# Altium schematic sheet pca10056_sheet3_pin_map.SchDoc: PCA10056 - Pin Map
size A3; Organization: Nordic Semiconductor; DocumentNumber: 3; SheetNumber: 3; SheetTotal: 7; CompanyName: Nordic Semiconductor
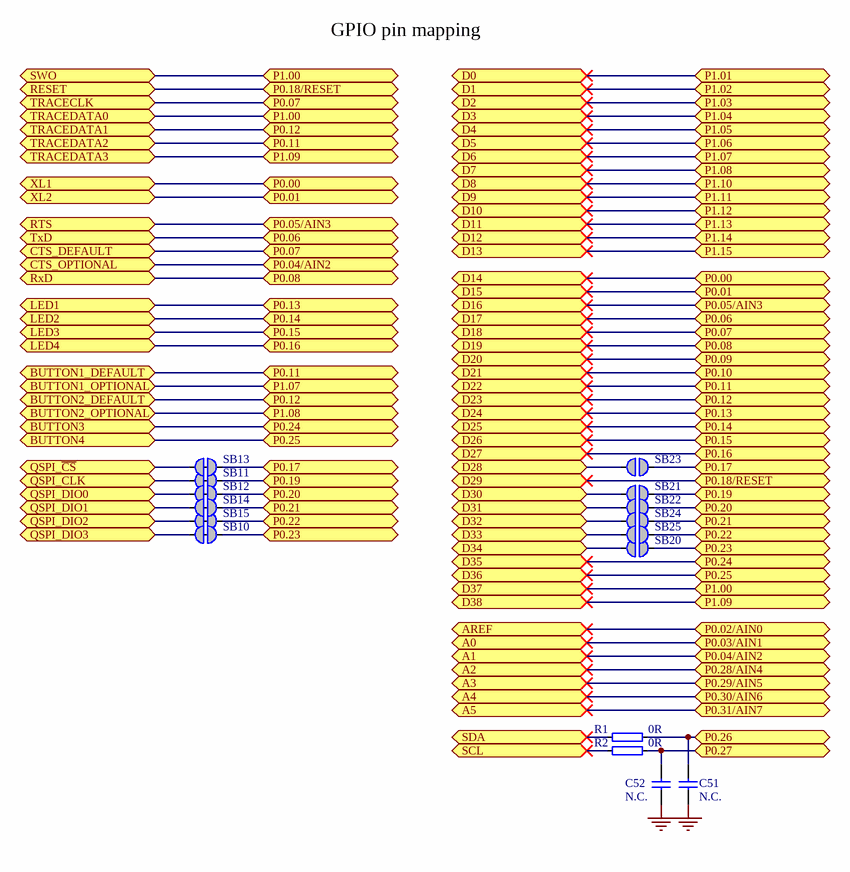
[diagram p0: pca10056_sheet3_pin_map.SchDoc]

## Parts
C51  N.C.  [CAPC1005X04L]
C52  N.C.  [CAPC1005X04L]
R1  0R  [RESC1005X04L]
R2  0R  [RESC1005X04L]
SB10  Solderbridge  [Solderbridge_Shorted]  (value not drawn)  (net tie, no BOM)
SB11  Solderbridge  [Solderbridge_Shorted]  (value not drawn)  (net tie, no BOM)
SB12  Solderbridge  [Solderbridge_Shorted]  (value not drawn)  (net tie, no BOM)
SB13  Solderbridge  [Solderbridge_Shorted]  (value not drawn)  (net tie, no BOM)
SB14  Solderbridge  [Solderbridge_Shorted]  (value not drawn)  (net tie, no BOM)
SB15  Solderbridge  [Solderbridge_Shorted]  (value not drawn)  (net tie, no BOM)
SB20  Solderbridge  [Solderbridge]  (value not drawn)  (no BOM)
SB21  Solderbridge  [Solderbridge]  (value not drawn)  (no BOM)
SB22  Solderbridge  [Solderbridge]  (value not drawn)  (no BOM)
SB23  Solderbridge  [Solderbridge]  (value not drawn)  (no BOM)
SB24  Solderbridge  [Solderbridge]  (value not drawn)  (no BOM)
SB25  Solderbridge  [Solderbridge]  (value not drawn)  (no BOM)

## Ports
A0 (bidir), A1 (bidir), A2 (bidir), A3 (bidir), A4 (bidir), A5 (bidir), AREF (bidir), BUTTON1_DEFAULT (bidir), BUTTON1_OPTIONAL (bidir), BUTTON2_DEFAULT (bidir), BUTTON2_OPTIONAL (bidir), BUTTON3 (bidir), BUTTON4 (bidir), CTS_DEFAULT (bidir), CTS_OPTIONAL (bidir), D0 (bidir), D1 (bidir), D2 (bidir), D3 (bidir), D4 (bidir), D5 (bidir), D6 (bidir), D7 (bidir), D8 (bidir), D9 (bidir), D10 (bidir), D11 (bidir), D12 (bidir), D13 (bidir), D14 (bidir), D15 (bidir), D16 (bidir), D17 (bidir), D18 (bidir), D19 (bidir), D20 (bidir), D21 (bidir), D22 (bidir), D23 (bidir), D24 (bidir), D25 (bidir), D26 (bidir), D27 (bidir), D28 (bidir), D29 (bidir), D30 (bidir), D31 (bidir), D32 (bidir), D33 (bidir), D34 (bidir), D35 (bidir), D36 (bidir), D37 (bidir), D38 (bidir), LED1 (bidir), LED2 (bidir), LED3 (bidir), LED4 (bidir), P0.00 (bidir), P0.01 (bidir), P0.02/AIN0 (bidir), P0.03/AIN1 (bidir), P0.04/AIN2 (bidir), P0.05/AIN3 (bidir), P0.06 (bidir), P0.07 (bidir), P0.08 (bidir), P0.09 (bidir), P0.10 (bidir), P0.11 (bidir), P0.12 (bidir), P0.13 (bidir), P0.14 (bidir), P0.15 (bidir), P0.16 (bidir), P0.17 (bidir), P0.18/RESET (bidir), P0.19 (bidir), P0.20 (bidir), P0.21 (bidir), P0.22 (bidir), P0.23 (bidir), P0.24 (bidir), P0.25 (bidir), P0.26 (bidir), P0.27 (bidir), P0.28/AIN4 (bidir), P0.29/AIN5 (bidir), P0.30/AIN6 (bidir), P0.31/AIN7 (bidir), P1.00 (bidir), P1.01 (bidir), P1.02 (bidir), P1.03 (bidir), P1.04 (bidir), P1.05 (bidir), P1.06 (bidir), P1.07 (bidir), P1.08 (bidir), P1.09 (bidir), P1.10 (bidir), P1.11 (bidir), P1.12 (bidir), P1.13 (bidir), P1.14 (bidir), P1.15 (bidir), QSPI_CLK (bidir), QSPI_DIO0 (bidir), QSPI_DIO1 (bidir), QSPI_DIO2 (bidir), QSPI_DIO3 (bidir), QSPI_~{CS} (bidir), RESET (bidir), RTS (bidir), RxD (bidir), SCL (bidir), SDA (bidir), SWO (bidir), TRACECLK (bidir), TRACEDATA0 (bidir), TRACEDATA1 (bidir), TRACEDATA2 (bidir), TRACEDATA3 (bidir), TxD (bidir), XL1 (bidir), XL2 (bidir)

## Nets
GND: C51.1 C52.2
A0: port A0, port P0.03/AIN1
A1: port P0.04/AIN2, port CTS_OPTIONAL, port A1
A2: port A2, port P0.28/AIN4
A3: port A3, port P0.29/AIN5
A4: port A4, port P0.30/AIN6
A5: port A5, port P0.31/AIN7
AREF: port AREF, port P0.02/AIN0
BUTTON1_DEFAULT: port TRACEDATA2, port P0.11, port BUTTON1_DEFAULT, port D22
BUTTON1_OPTIONAL: port P1.07, port BUTTON1_OPTIONAL, port D6
BUTTON2_DEFAULT: port TRACEDATA1, port P0.12, port BUTTON2_DEFAULT, port D23
BUTTON2_OPTIONAL: port P1.08, port BUTTON2_OPTIONAL, port D7
BUTTON3: port P0.24, port BUTTON3, port D35
BUTTON4: port P0.25, port BUTTON4, port D36
CTS_DEFAULT: port P0.07, port TRACECLK, port CTS_DEFAULT, port D18
D0: port P1.01, port D0
D1: port P1.02, port D1
D2: port P1.03, port D2
D3: port P1.04, port D3
D4: port P1.05, port D4
D5: port P1.06, port D5
D8: port P1.10, port D8
D9: port P1.11, port D9
D10: port P1.12, port D10
D11: port P1.13, port D11
D12: port P1.14, port D12
D13: port P1.15, port D13
D14: port P0.00, port XL1, port D14
D15: port P0.01, port XL2, port D15
D16: port RTS, port D16, port P0.05/AIN3
D17: port TxD, port P0.06, port D17
D19: port RxD, port P0.08, port D19
D20: port D20, port P0.09
D21: port D21, port P0.10
D24: port P0.13, port LED1, port D24
D25: port P0.14, port LED2, port D25
D26: port P0.15, port LED3, port D26
D27: port P0.16, port LED4, port D27
D28: SB23.2 ; port D28
D29: port RESET, port P0.18/RESET, port D29
D30: SB21.2 ; port D30
D31: SB22.2 ; port D31
D32: SB24.2 ; port D32
D33: SB25.2 ; port D33
D34: SB20.2 ; port D34
D37: port TRACEDATA0, port SWO, port P1.00, port D37
D38: port TRACEDATA3, port P1.09, port D38
P0.17: SB13.1 SB23.1 ; port P0.17
P0.19: SB11.1 SB21.1 ; port P0.19
P0.20: SB12.1 SB22.1 ; port P0.20
P0.21: SB14.1 SB24.1 ; port P0.21
P0.22: SB15.1 SB25.1 ; port P0.22
P0.23: SB10.1 SB20.1 ; port P0.23
P0.26: C51.2 R1.2 ; port P0.26
P0.27: C52.1 R2.2 ; port P0.27
QSPI_~{CS}: SB13.2 ; port QSPI_~{CS}
QSPI_CLK: SB11.2 ; port QSPI_CLK
QSPI_DIO0: SB12.2 ; port QSPI_DIO0
QSPI_DIO1: SB14.2 ; port QSPI_DIO1
QSPI_DIO2: SB15.2 ; port QSPI_DIO2
QSPI_DIO3: SB10.2 ; port QSPI_DIO3
SCL: R2.1 ; port SCL
SDA: R1.1 ; port SDA

## Notes on the sheet
- GPIO pin mapping
- Size
- Date:
- A3
- Project Number
- Sheet         of
- Revision
- File:
- Drawn By:

## Library data of the parts
C51 C52 = C0402-N.C.: Not mounted; Assembly: Not mounted; Note: Chip Cap; Artikkelnr Noca: N.A.; Part Number: C0402-N.C.; Manufacturer: *; Manufacturer Part Number: *; Datasheet: *; Footprint Doc: 0402; LatestRevisionDate: 2009-05-08; Pin Count: 2; Publisher: Nordic Semiconductor; Published: 2009-05-08; Value: N.C.; Supplier: *; Supplier part number: *; 2nd source Supplier: *; 2nd source part number: *; Artikkelnr Simpro: N.A.
R1 R2 = R0402-0R: Resistor, ±5%, 0.063W; Note: Chip Res 5%; Artikkelnr Noca: 27049000; Artikkelnr Simpro: N.A.; Value Ohm: 0; Part Number: R0402-0R; Manufacturer: *; Manufacturer Part Number: *; Datasheet: *; Footprint Doc: 0402; LatestRevisionDate: 2009-11-23; Pin Count: 2; Publisher: Nordic Semiconductor; Published: 2009-05-08; Value: 0R; Supplier: Farnell; Supplier part number: 146-9661; 2nd source Supplier: *; 2nd source part number: *
SB10-SB15 = Solderbridge Shorted: Shorted Solderbridge; Artikkelnr Noca: N.A.; Part Number: Solderbridge Shorted; Manufacturer: *; Manufacturer Part Number: *; Datasheet: *; Footprint Doc: Solderbridge_Shorted; LatestRevisionDate: 2012-08-07; Pin Count: 2; Publisher: Nordic Semiconductor; Published: 2012-08-07; Value: Solderbridge; Note: *; Supplier: *; Supplier part number: *; 2nd source Supplier: *; 2nd source part number: *; Artikkelnr Simpro: N.A.
SB20-SB25 = Solderbridge: Artikkelnr Noca: N.A.; Part Number: Solderbridge; Manufacturer: *; Manufacturer Part Number: *; Datasheet: *; Footprint Doc: Solderbridge; LatestRevisionDate: 2009-12-14; Pin Count: 2; Publisher: Nordic Semiconductor; Published: 2009-12-14; Value: Solderbridge; Note: *; Supplier: *; Supplier part number: *; 2nd source Supplier: *; 2nd source part number: *; Artikkelnr Simpro: N.A.